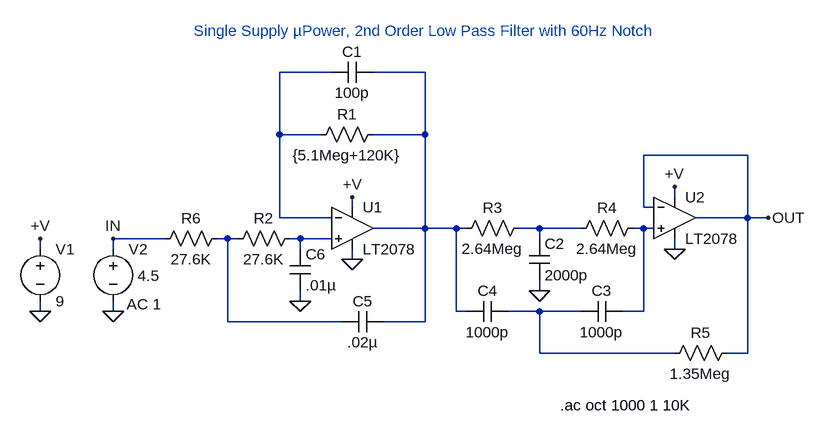
[diagram p0: schematic LT2078.asc]
LT2078.asc, the LTspice schematic file:
Version 4
SHEET 1 1220 680
WIRE 160 0 80 0
WIRE 304 0 224 0
WIRE 80 96 80 0
WIRE 144 96 80 96
WIRE 304 96 304 0
WIRE 304 96 224 96
WIRE 800 128 640 128
WIRE 688 192 688 176
WIRE 192 208 192 192
WIRE 640 208 640 128
WIRE 656 208 640 208
WIRE 80 224 80 96
WIRE 160 224 80 224
WIRE 800 224 800 128
WIRE 800 224 720 224
WIRE 832 224 800 224
WIRE 304 240 304 96
WIRE 304 240 224 240
WIRE 352 240 304 240
WIRE 368 240 352 240
WIRE 480 240 448 240
WIRE 544 240 480 240
WIRE 640 240 624 240
WIRE 656 240 640 240
WIRE -96 256 -176 256
WIRE 0 256 -16 256
WIRE 16 256 0 256
WIRE 112 256 96 256
WIRE 160 256 112 256
WIRE 480 256 480 240
WIRE -288 272 -288 256
WIRE -176 272 -176 256
WIRE 112 272 112 256
WIRE 688 272 688 256
WIRE 192 288 192 272
WIRE 480 336 480 320
WIRE 112 352 112 336
WIRE -288 368 -288 352
WIRE -176 368 -176 352
WIRE 352 368 352 240
WIRE 368 368 352 368
WIRE 480 368 432 368
WIRE 544 368 480 368
WIRE 640 368 640 240
WIRE 640 368 608 368
WIRE 0 384 0 256
WIRE 176 384 0 384
WIRE 304 384 304 240
WIRE 304 384 240 384
WIRE 480 432 480 368
WIRE 688 432 480 432
WIRE 800 432 800 224
WIRE 800 432 768 432
FLAG -288 368 0
FLAG 192 192 +V
FLAG -288 256 +V
FLAG 688 176 +V
FLAG 112 352 0
FLAG -176 368 0
FLAG 832 224 OUT
FLAG -176 256 IN
FLAG 192 288 0
FLAG 688 272 0
FLAG 480 336 0
SYMBOL voltage -288 256 R0
SYMATTR InstName V1
SYMATTR Value 9
SYMBOL res 240 80 R90
WINDOW 0 0 56 VBottom 2
WINDOW 3 32 56 VTop 2
SYMATTR InstName R1
SYMATTR Value {5.1Meg+120K}
SYMBOL opamps\\LT2078 192 176 R0
SYMATTR InstName U1
SYMBOL cap 224 -16 R90
WINDOW 0 0 32 VBottom 2
WINDOW 3 32 32 VTop 2
SYMATTR InstName C1
SYMATTR Value 100p
SYMBOL res 464 224 R90
WINDOW 0 0 56 VBottom 2
WINDOW 3 32 56 VTop 2
SYMATTR InstName R3
SYMATTR Value 2.64Meg
SYMBOL res 640 224 R90
WINDOW 0 0 56 VBottom 2
WINDOW 3 32 56 VTop 2
SYMATTR InstName R4
SYMATTR Value 2.64Meg
SYMBOL cap 464 256 R0
SYMATTR InstName C2
SYMATTR Value 2000p
SYMBOL res 784 416 R90
WINDOW 0 0 56 VBottom 2
WINDOW 3 32 56 VTop 2
SYMATTR InstName R5
SYMATTR Value 1.35Meg
SYMBOL cap 608 352 R90
WINDOW 0 0 32 VBottom 2
WINDOW 3 32 32 VTop 2
SYMATTR InstName C3
SYMATTR Value 1000p
SYMBOL cap 432 352 R90
WINDOW 0 0 32 VBottom 2
WINDOW 3 32 32 VTop 2
SYMATTR InstName C4
SYMATTR Value 1000p
SYMBOL res 112 240 R90
WINDOW 0 0 56 VBottom 2
WINDOW 3 32 56 VTop 2
SYMATTR InstName R2
SYMATTR Value 27.6K
SYMBOL res 0 240 R90
WINDOW 0 0 56 VBottom 2
WINDOW 3 32 56 VTop 2
SYMATTR InstName R6
SYMATTR Value 27.6K
SYMBOL cap 240 368 R90
WINDOW 0 0 32 VBottom 2
WINDOW 3 32 32 VTop 2
SYMATTR InstName C5
SYMATTR Value .02µ
SYMBOL cap 96 272 R0
SYMATTR InstName C6
SYMATTR Value .01µ
SYMBOL voltage -176 256 R0
WINDOW 3 38 57 Left 2
WINDOW 123 21 101 Left 2
SYMATTR Value 4.5
SYMATTR Value2 AC 1
SYMATTR InstName V2
SYMBOL opamps\\LT2078 688 160 R0
SYMATTR InstName U2
TEXT 512 512 Left 2 !.ac oct 1000 1 10K
TEXT 304 -48 Bottom 2 ;Single Supply µPower, 2nd Order Low Pass Filter with 60Hz Notch

The netlist it stands for:
* LT2078.asc
V1 +V 0 9
R1 N002 N001 {5.1Meg+120K}
XU1 N006 N001 +V 0 N002 LT2078  ; pins In+ In- V+ V- OUT
C1 N002 N001 100p
R3 N003 N002 2.64Meg
R4 N004 N003 2.64Meg
C2 N003 0 2000p
R5 OUT N007 1.35Meg
C3 N004 N007 1000p
C4 N007 N002 1000p
R2 N006 N005 27.6K
R6 N005 IN 27.6K
C5 N002 N005 .02µ
C6 N006 0 .01µ
V2 IN 0 4.5 AC 1
XU2 N004 OUT +V 0 OUT LT2078  ; pins In+ In- V+ V- OUT
.ac oct 1000 1 10K
* Single Supply µPower, 2nd Order Low Pass Filter with 60Hz Notch
.backanno
.end